# Altium schematic sheet BackPage.SchDoc: Back Page
size Letter; Engineer: Brandt Buchda; SheetNumber: 4; SheetTotal: 4
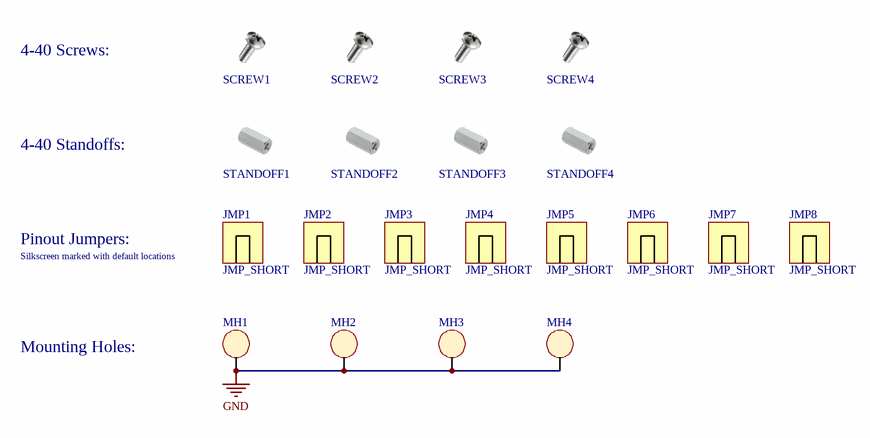
[diagram p0: BackPage.SchDoc]

## Parts
JMP1  JMP_SHORT  (mechanical)
JMP2  JMP_SHORT  (mechanical)
JMP3  JMP_SHORT  (mechanical)
JMP4  JMP_SHORT  (mechanical)
JMP5  JMP_SHORT  (mechanical)
JMP6  JMP_SHORT  (mechanical)
JMP7  JMP_SHORT  (mechanical)
JMP8  JMP_SHORT  (mechanical)
MH1  MOUNT_HOLE  [MOUNTING_HOLE]  (value not drawn)  (no BOM)
MH2  MOUNT_HOLE  [MOUNTING_HOLE]  (value not drawn)  (no BOM)
MH3  MOUNT_HOLE  [MOUNTING_HOLE]  (value not drawn)  (no BOM)
MH4  MOUNT_HOLE  [MOUNTING_HOLE]  (value not drawn)  (no BOM)
SCREW1  9900  (value not drawn)  (mechanical)
SCREW2  9900  (value not drawn)  (mechanical)
SCREW3  9900  (value not drawn)  (mechanical)
SCREW4  9900  (value not drawn)  (mechanical)
STANDOFF1  2057-440-AL-7  (value not drawn)  (mechanical)
STANDOFF2  2057-440-AL-7  (value not drawn)  (mechanical)
STANDOFF3  2057-440-AL-7  (value not drawn)  (mechanical)
STANDOFF4  2057-440-AL-7  (value not drawn)  (mechanical)

## Nets
GND: MH1.1 MH2.1 MH3.1 MH4.1

## Notes on the sheet
- 4-40 Screws:
- 4-40 Standoffs:
- Pinout Jumpers:
- (near JMP1) Silkscreen marked with default locations
- Mounting Holes:
- Title:
- File:
- Sheet:
- of
- Revision:
- Time:
- Date:
- Engineer:

## Library data of the parts
JMP1-JMP8 = JUMPER_SHORT: CONN JUMPER SHORTING .100" GOLD; Supplier 1: Digi-Key; Supplier Part Number 1: S9337-ND
MH1-MH4 = MOUNT_HOLE: MOUNTING HOLE
SCREW1-SCREW4 = SCREW 4-40: #4-40 Pan Head Machine Screw Phillips Drive Stainless Steel; Supplier 1: Digi-Key; Supplier Part Number 1: 36-9900-ND
STANDOFF1-STANDOFF4 = Standoff 4-40: Hex Standoff Threaded #4-40 Aluminum 0.500" (12.70mm) 1/2"; Supplier 1: Digi-Key; Supplier Part Number 1: 1772-1993-ND